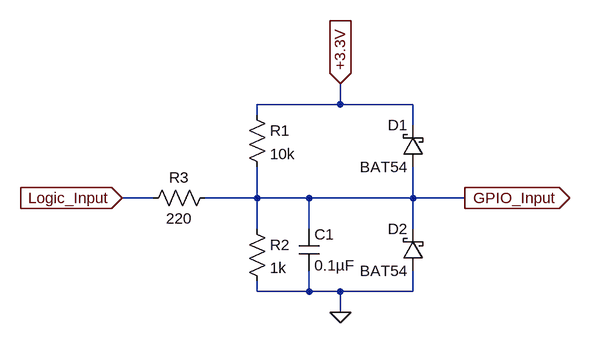
[diagram p0: schematic Draft1.asc]
Draft1.asc, the LTspice schematic file:
Version 4
SHEET 1 880 680
WIRE 160 0 160 -32
WIRE 160 0 32 0
WIRE 272 0 160 0
WIRE 32 16 32 0
WIRE 272 32 272 0
WIRE -128 144 -176 144
WIRE 32 144 32 96
WIRE 32 144 -48 144
WIRE 112 144 32 144
WIRE 272 144 272 96
WIRE 272 144 112 144
WIRE 352 144 272 144
WIRE 32 192 32 144
WIRE 112 192 112 144
WIRE 272 192 272 144
WIRE 32 288 32 272
WIRE 112 288 112 256
WIRE 112 288 32 288
WIRE 160 288 112 288
WIRE 272 288 272 256
WIRE 272 288 160 288
WIRE 160 320 160 288
FLAG -176 144 Logic_Input
IOPIN -176 144 In
FLAG 160 320 0
FLAG 160 -32 +3.3V
IOPIN 160 -32 In
FLAG 352 144 GPIO_Input
IOPIN 352 144 Out
SYMBOL res -32 128 R90
WINDOW 0 0 56 VBottom 2
WINDOW 3 32 56 VTop 2
SYMATTR InstName R3
SYMATTR Value 220
SYMBOL res 16 0 R0
SYMATTR InstName R1
SYMATTR Value 10k
SYMBOL res 16 176 R0
SYMATTR InstName R2
SYMATTR Value 1k
SYMBOL cap 96 192 R0
SYMATTR InstName C1
SYMATTR Value 0.1µF
SYMBOL schottky 288 96 R180
WINDOW 0 24 64 Left 2
WINDOW 3 24 0 Left 2
SYMATTR InstName D1
SYMATTR Value BAT54
SYMATTR Description Diode
SYMATTR Type diode
SYMBOL schottky 288 256 R180
WINDOW 0 24 64 Left 2
WINDOW 3 24 0 Left 2
SYMATTR InstName D2
SYMATTR Value BAT54
SYMATTR Description Diode
SYMATTR Type diode

The netlist it stands for:
* Draft1.asc
R3 GPIO_Input Logic_Input 220
R1 +3.3V GPIO_Input 10k
R2 GPIO_Input 0 1k
C1 GPIO_Input 0 0.1µF
D1 GPIO_Input +3.3V BAT54
D2 0 GPIO_Input BAT54
.model D D
.lib standard.dio
.backanno
.end